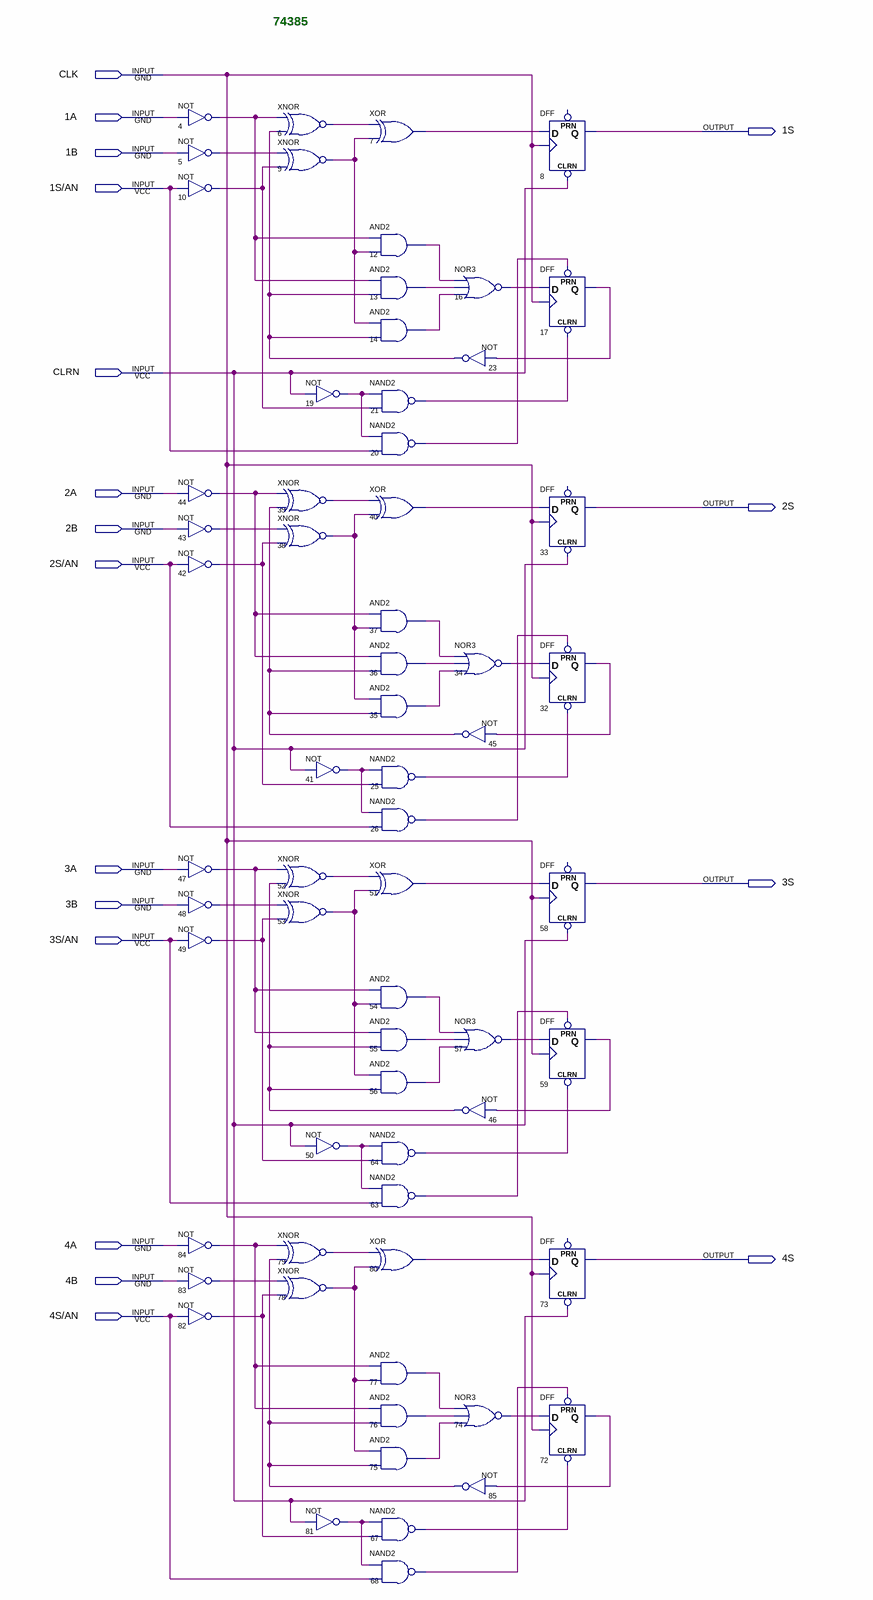
[diagram p0: schematic sheet]
// Quartus schematic 74385.bdf as structural Verilog: 64 symbols, 18 pins
module \74385  (
  input  CLK,
  input  \1A ,
  input  \1B ,
  input  \1S/AN ,
  input  CLRN,
  input  \2A ,
  input  \2B ,
  input  \2S/AN ,
  input  \3A ,
  input  \3B ,
  input  \3S/AN ,
  input  \4A ,
  input  \4B ,
  input  \4S/AN ,
  output \1S ,
  output \2S ,
  output \3S ,
  output \4S 
);

  wire n4_out, n5_out, n6_out, n7_out, n9_out, n10_out, n12_out, n13_out, n14_out, n16_out, n17_q, n19_out,
       n20_out, n21_out, n23_out, n25_out, n26_out, n32_q, n34_out, n35_out, n36_out, n37_out, n38_out,
       n39_out, n40_out, n41_out, n42_out, n43_out, n44_out, n45_out, n46_out, n47_out, n48_out, n49_out,
       n50_out, n51_out, n52_out, n53_out, n54_out, n55_out, n56_out, n57_out, n59_q, n63_out, n64_out,
       n67_out, n68_out, n72_q, n74_out, n75_out, n76_out, n77_out, n78_out, n79_out, n80_out, n81_out,
       n82_out, n83_out, n84_out, n85_out;

  not u_4 (n4_out, \1A );
  not u_5 (n5_out, \1B );
  not u_10 (n10_out, \1S/AN );
  not u_44 (n44_out, \2A );
  not u_43 (n43_out, \2B );
  not u_42 (n42_out, \2S/AN );
  not u_47 (n47_out, \3A );
  not u_48 (n48_out, \3B );
  not u_49 (n49_out, \3S/AN );
  not u_84 (n84_out, \4A );
  not u_83 (n83_out, \4B );
  not u_82 (n82_out, \4S/AN );
  xnor u_6 (n6_out, n4_out, n23_out);
  xnor u_9 (n9_out, n5_out, n10_out);
  xnor u_39 (n39_out, n44_out, n45_out);
  xnor u_38 (n38_out, n43_out, n42_out);
  xnor u_52 (n52_out, n47_out, n46_out);
  xnor u_53 (n53_out, n48_out, n49_out);
  xnor u_79 (n79_out, n84_out, n85_out);
  xnor u_78 (n78_out, n83_out, n82_out);
  not u_19 (n19_out, CLRN);
  not u_41 (n41_out, CLRN);
  not u_50 (n50_out, CLRN);
  not u_81 (n81_out, CLRN);
  xor u_7 (n7_out, n6_out, n9_out);
  and u_12 (n12_out, n4_out, n9_out);
  and u_13 (n13_out, n4_out, n23_out);
  and u_14 (n14_out, n9_out, n23_out);
  nand u_21 (n21_out, n19_out, n10_out);
  nand u_20 (n20_out, n19_out, \1S/AN );
  xor u_40 (n40_out, n39_out, n38_out);
  and u_37 (n37_out, n44_out, n38_out);
  and u_36 (n36_out, n44_out, n45_out);
  and u_35 (n35_out, n38_out, n45_out);
  nand u_25 (n25_out, n41_out, n42_out);
  nand u_26 (n26_out, n41_out, \2S/AN );
  xor u_51 (n51_out, n52_out, n53_out);
  and u_54 (n54_out, n47_out, n53_out);
  and u_55 (n55_out, n47_out, n46_out);
  and u_56 (n56_out, n53_out, n46_out);
  nand u_64 (n64_out, n50_out, n49_out);
  nand u_63 (n63_out, n50_out, \3S/AN );
  xor u_80 (n80_out, n79_out, n78_out);
  and u_77 (n77_out, n84_out, n78_out);
  and u_76 (n76_out, n84_out, n85_out);
  and u_75 (n75_out, n78_out, n85_out);
  nand u_67 (n67_out, n81_out, n82_out);
  nand u_68 (n68_out, n81_out, \4S/AN );
  nor u_16 (n16_out, n12_out, n13_out, n14_out);
  not u_23 (n23_out, n17_q);
  nor u_34 (n34_out, n37_out, n36_out, n35_out);
  not u_45 (n45_out, n32_q);
  nor u_57 (n57_out, n54_out, n55_out, n56_out);
  not u_46 (n46_out, n59_q);
  nor u_74 (n74_out, n77_out, n76_out, n75_out);
  not u_85 (n85_out, n72_q);
  DFF u_8 (.CLRN(CLRN), .CLK(CLK), .D(n7_out), .Q(\1S ));  // open: PRN
  DFF u_17 (.CLRN(n21_out), .CLK(CLK), .D(n16_out), .PRN(n20_out), .Q(n17_q));
  DFF u_33 (.CLRN(CLRN), .CLK(CLK), .D(n40_out), .Q(\2S ));  // open: PRN
  DFF u_32 (.CLRN(n25_out), .CLK(CLK), .D(n34_out), .PRN(n26_out), .Q(n32_q));
  DFF u_58 (.CLRN(CLRN), .CLK(CLK), .D(n51_out), .Q(\3S ));  // open: PRN
  DFF u_59 (.CLRN(n64_out), .CLK(CLK), .D(n57_out), .PRN(n63_out), .Q(n59_q));
  DFF u_73 (.CLRN(CLRN), .CLK(CLK), .D(n80_out), .Q(\4S ));  // open: PRN
  DFF u_72 (.CLRN(n67_out), .CLK(CLK), .D(n74_out), .PRN(n68_out), .Q(n72_q));

  // Notes on the sheet:
  //   74385
endmodule
